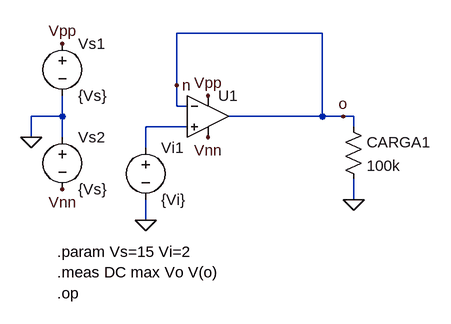
[diagram p0: schematic ex1f.asc]
ex1f.asc, the LTspice schematic file:
Version 4
SHEET 1 880 680
WIRE 352 32 128 32
WIRE 128 112 128 32
WIRE 128 144 128 112
WIRE 144 144 128 144
WIRE -48 160 -48 128
WIRE -48 160 -96 160
WIRE 352 160 352 32
WIRE 352 160 208 160
WIRE 384 160 352 160
WIRE 400 160 384 160
WIRE 144 176 80 176
WIRE 400 176 400 160
WIRE -96 192 -96 160
WIRE -48 192 -48 160
WIRE 80 208 80 176
WIRE 400 288 400 256
WIRE 80 320 80 288
FLAG 80 320 0
FLAG 400 288 0
FLAG -96 192 0
FLAG -48 48 Vpp
FLAG -48 272 Vnn
FLAG 384 160 o
FLAG 176 128 Vpp
FLAG 176 192 Vnn
FLAG 128 112 n
SYMBOL voltage 80 192 R0
SYMATTR InstName Vi1
SYMATTR Value {Vi}
SYMBOL OpAmps\\UniversalOpAmp2 176 160 R0
SYMATTR InstName U1
SYMATTR Value2 Avol=125 GBW=10Meg Slew=10Meg
SYMBOL voltage -48 32 R0
SYMATTR InstName Vs1
SYMATTR Value {Vs}
SYMBOL voltage -48 176 R0
SYMATTR InstName Vs2
SYMATTR Value {Vs}
SYMBOL res 384 160 R0
SYMATTR InstName CARGA1
SYMATTR Value 100k
TEXT -56 368 Left 2 !.param Vs=15 Vi=2
TEXT -56 432 Left 2 !.op
TEXT -56 400 Left 2 !.meas DC max Vo V(o)

The netlist it stands for:
* ex1f.asc
Vi1 N001 0 {Vi}
XU1 N001 n Vpp Vnn n level2 Avol=125 GBW=10Meg Slew=10Meg Ilimit=25m Rail=0 Vos=0 En=0 Enk=0 In=0 Ink=0 Rin=500Meg  ; pins In+ In- V+ V- OUT
Vs1 Vpp 0 {Vs}
Vs2 0 Vnn {Vs}
R§CARGA1 n 0 100k
.param Vs=15 Vi=2
.op
.meas DC max Vo V(o)
.lib UniversalOpAmp2.lib
.backanno
.end